# EAGLE design Flodar_Board_V1-2 (EAGLE 9.6.2)
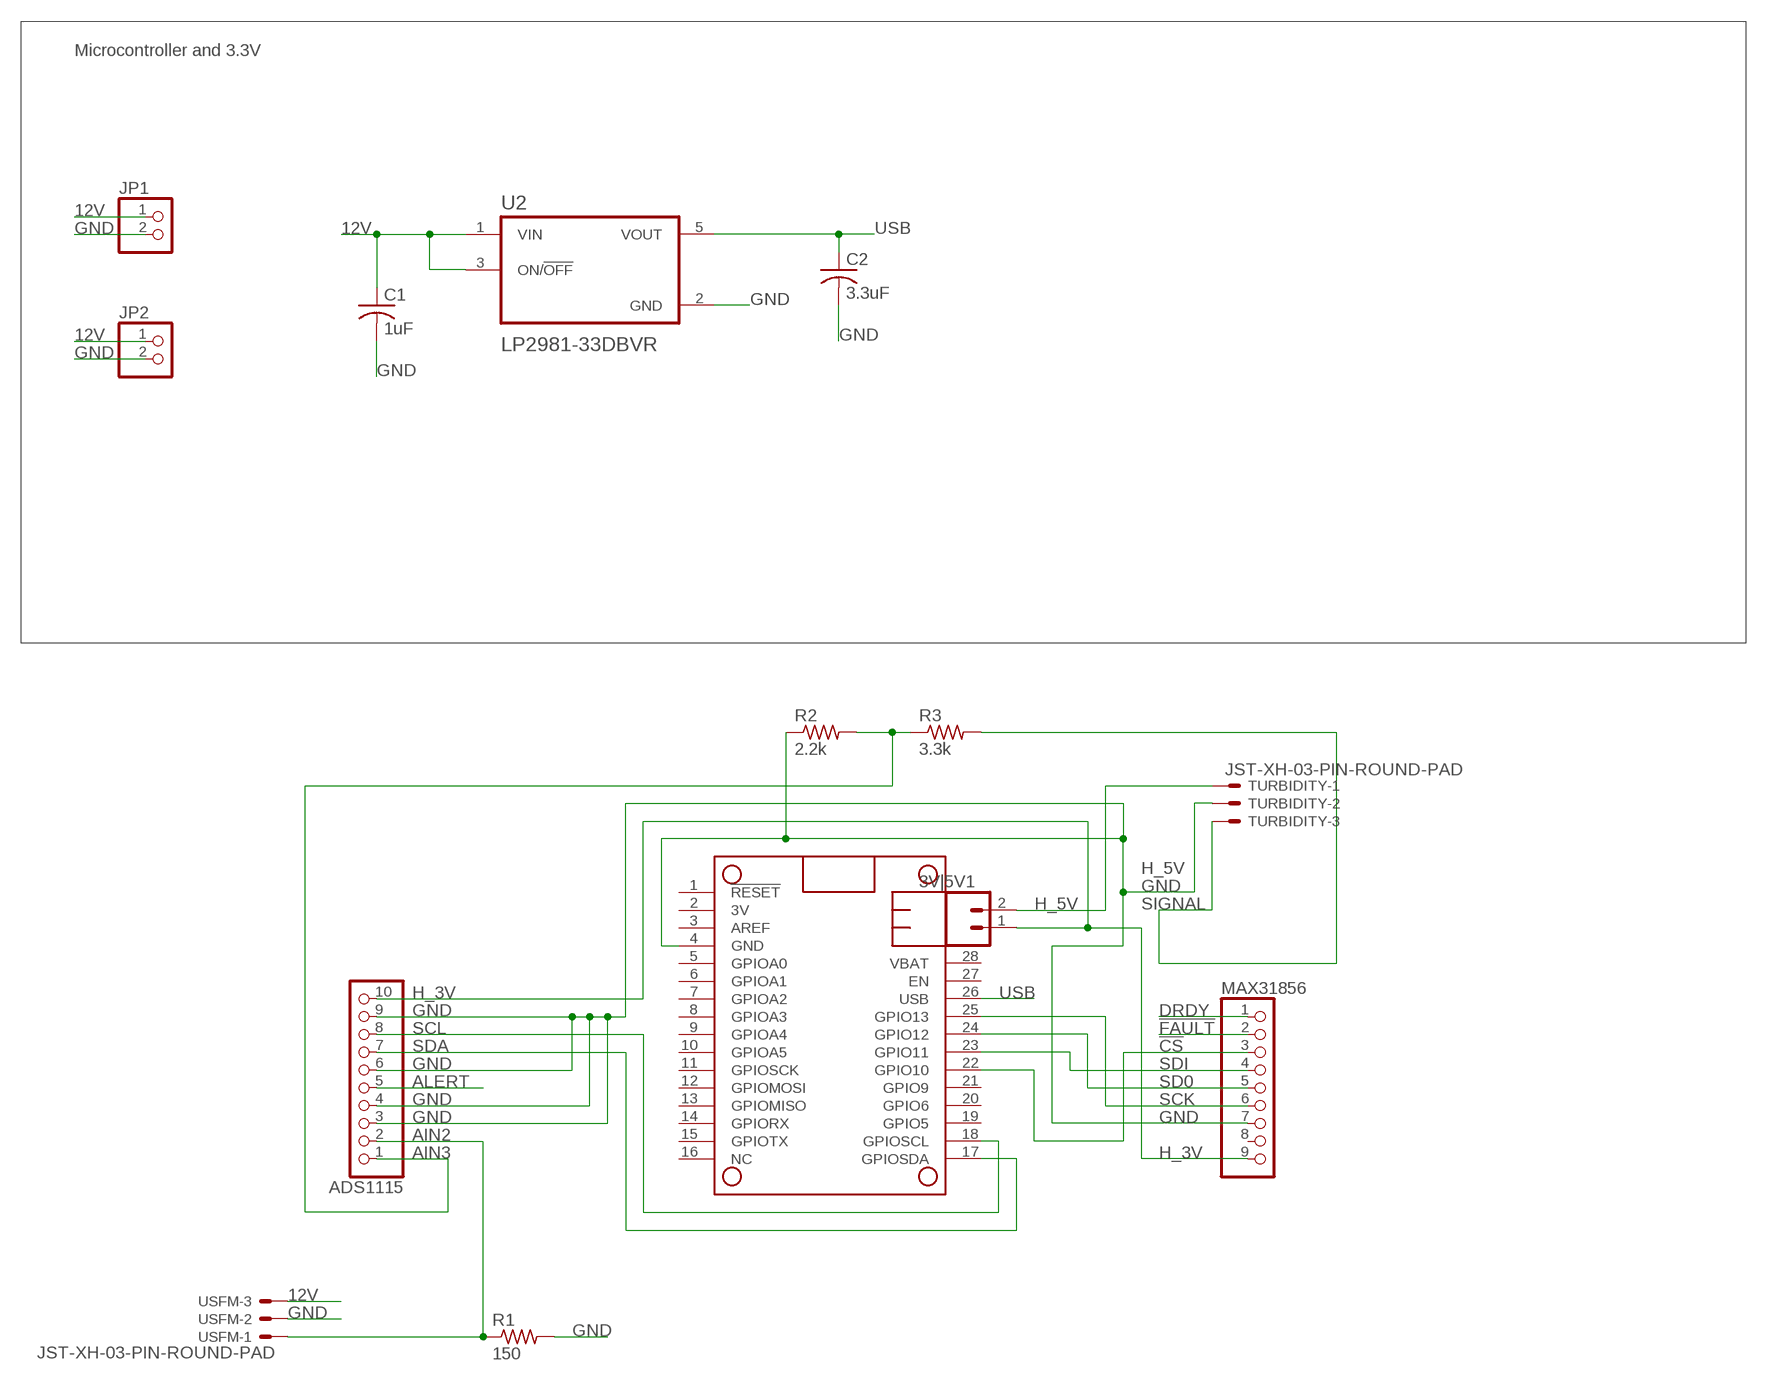
[diagram p0: schematic, sheet 1]

## Parts
3V|5V1  CONN_021X02_NO_SILK  [1X02_NO_SILK]
ADS1115  HEADER-1X1070MIL  [1X10_ROUND70]
C1  1uF  C-USC1206  [C1206]
C2  3.3uF  C-USC1206  [C1206]
JP1  PINHD-1X2  [1X02]
JP2  PINHD-1X2  [1X02]
MAX31856  HEADER-1X970MIL  [1X09_ROUND_70]
MS3  FEATHERWING  [FEATHERWING]
R1  150  R-US_R1206  [R1206]
R2  2.2k  R-US_R1206  [R1206]
R3  3.3k  R-US_R1206  [R1206]
TURBIDITY  JST-XH-03-PIN-ROUND-PAD  [JST-XH-03-PACKAGE-ROUND-PAD]
U2  LP2981-33DBVR  LP2981-50DBVR  [SOT95P280X145-5N]
USFM  JST-XH-03-PIN-ROUND-PAD  [JST-XH-03-PACKAGE-ROUND-PAD]

## Nets
12V: C1.1 JP1.1 JP2.1 U2.1(VIN) U2.3(ON/!OFF) USFM.3
!CS: MAX31856.3 MS3.22(GPIO10)
!FAULT: MAX31856.2
AIN2: ADS1115.2 R1.1 USFM.1
AIN3: ADS1115.1 R2.2 R3.1
ALERT: ADS1115.5
DRDY: MAX31856.1
GND: ADS1115.3 ADS1115.4 ADS1115.6 ADS1115.9 C1.2 C2.2 JP1.2 JP2.2 MAX31856.7 MS3.4(GND) R1.2 R2.1 TURBIDITY.2 U2.2(GND) USFM.2
H_3V: 3V|5V1.1 ADS1115.10 MAX31856.9
H_5V: 3V|5V1.2 TURBIDITY.1
SCK: MAX31856.6 MS3.25(GPIO13)
SCL: ADS1115.8 MS3.18(GPIOSCL)
SD0: MAX31856.5 MS3.24(GPIO12)
SDA: ADS1115.7 MS3.17(GPIOSDA)
SDI: MAX31856.4 MS3.23(GPIO11)
SIGNAL: R3.2 TURBIDITY.3
USB: C2.1 MS3.26(USB) U2.5(VOUT)
Unconnected: MAX31856.8 MS3.1(!RESET) MS3.2(3V) MS3.3(AREF) MS3.5(GPIOA0) MS3.6(GPIOA1) MS3.7(GPIOA2) MS3.8(GPIOA3) MS3.9(GPIOA4) MS3.10(GPIOA5) MS3.11(GPIOSCK) MS3.12(GPIOMOSI) MS3.13(GPIOMISO) MS3.14(GPIORX) MS3.15(GPIOTX) MS3.16(NC) MS3.19(GPIO5) MS3.20(GPIO6) MS3.21(GPIO9) MS3.27(EN) MS3.28(VBAT)

## Notes on the sheet
- Microcontroller and 3.3V

## Library data of the parts
3V|5V1 = SparkFun-Connectors:CONN_02: Multi connection point. Often used as Generic Header-pin footprint for 0.1 inch spaced/style header connections On any of the 0.1 inch spaced packages, you can populate with these: Break Away Headers - Straight <https://www.sparkfun.com/products/116> (PRT-00116) Break Away Male Headers - Right Angle <https://www.sparkfun.com/products/553> (PRT-00553) Female Headers <https://www.sparkfun.com/products/115> (PRT-00115) Break Away Headers - Machine Pin <https://www.sparkfun.com/products/117> (PRT-00117) Break Away Female Headers - Swiss Machine Pin <https://www.sparkfun.com/products/743> (PRT-00743) For SCREWTERMINALS and SPRING TERMINALS visit here: Screw Terimnals on SparkFun.com <https://www.sparkfun.com/search/results?term=Screw+Terminals> (5mm/3.5mm/2.54mm spacing) This device is also useful as a general connection point to wire up your design to another part of your project. Our various solder wires solder well into these plated through hole pads. Hook-Up Wire - Assortment (Stranded, 22 AWG) <https://www.sparkfun.com/products/11375> (PRT-11375) Hook-Up Wire - Assortment (Solid Core, 22 AWG) <https://www.sparkfun.com/products/11367> (PRT-11367) View the entire wire category on our website here <https://www.sparkfun.com/categories/141> Special notes: Molex polarized connector foot print use with: PRT-08233 with associated crimp pins and housings. 2.54_SCREWTERM for use with PRT-10571. 3.5mm Screw Terminal footprints for PRT-08084 5mm Screw Terminal footprints for use with PRT-08432
ADS1115 = microbuilder:HEADER-1X10: PIN HEADER
C1 C2 = rcl:C-US: CAPACITOR, American symbol; SPICEPREFIX: C
JP1 JP2 = pinhead:PINHD-1X2: PIN HEADER
MAX31856 = microbuilder:HEADER-1X9: PIN HEADER
MS3 = adafruit_wing:FEATHERWING
R1-R3 = adafruit:R-US_: RESISTOR, American symbol
TURBIDITY USFM = Rembrandt Electronics - JST XH Connectors v1-0:JST-XH-03-PIN: JST XH Connector 2 Pin Wire to board connector. Pitch: 2,54 mm, (0.100") Number of pins: 3 Created by Rembrandt Electronics www.rembrandtelectronics.com
U2 = LP2981-33DBVR:LP2981-50DBVR: Check prices <https://pricing.snapeda.com/parts/LP2981-50DBVR/Texas%20Instruments/view-part?ref=eda>; AVAILABILITY: In Stock; DESCRIPTION: 100-mA, 16-V, low-dropout voltage regulator with enable 5-SOT-23 -40 to 125; MF: Texas Instruments; MP: LP2981-50DBVR; PACKAGE: SOT-23-5 Texas Instruments; PRICE: None; PURCHASE-URL: https://pricing.snapeda.com/search/part/LP2981-50DBVR/?ref=eda

## Board
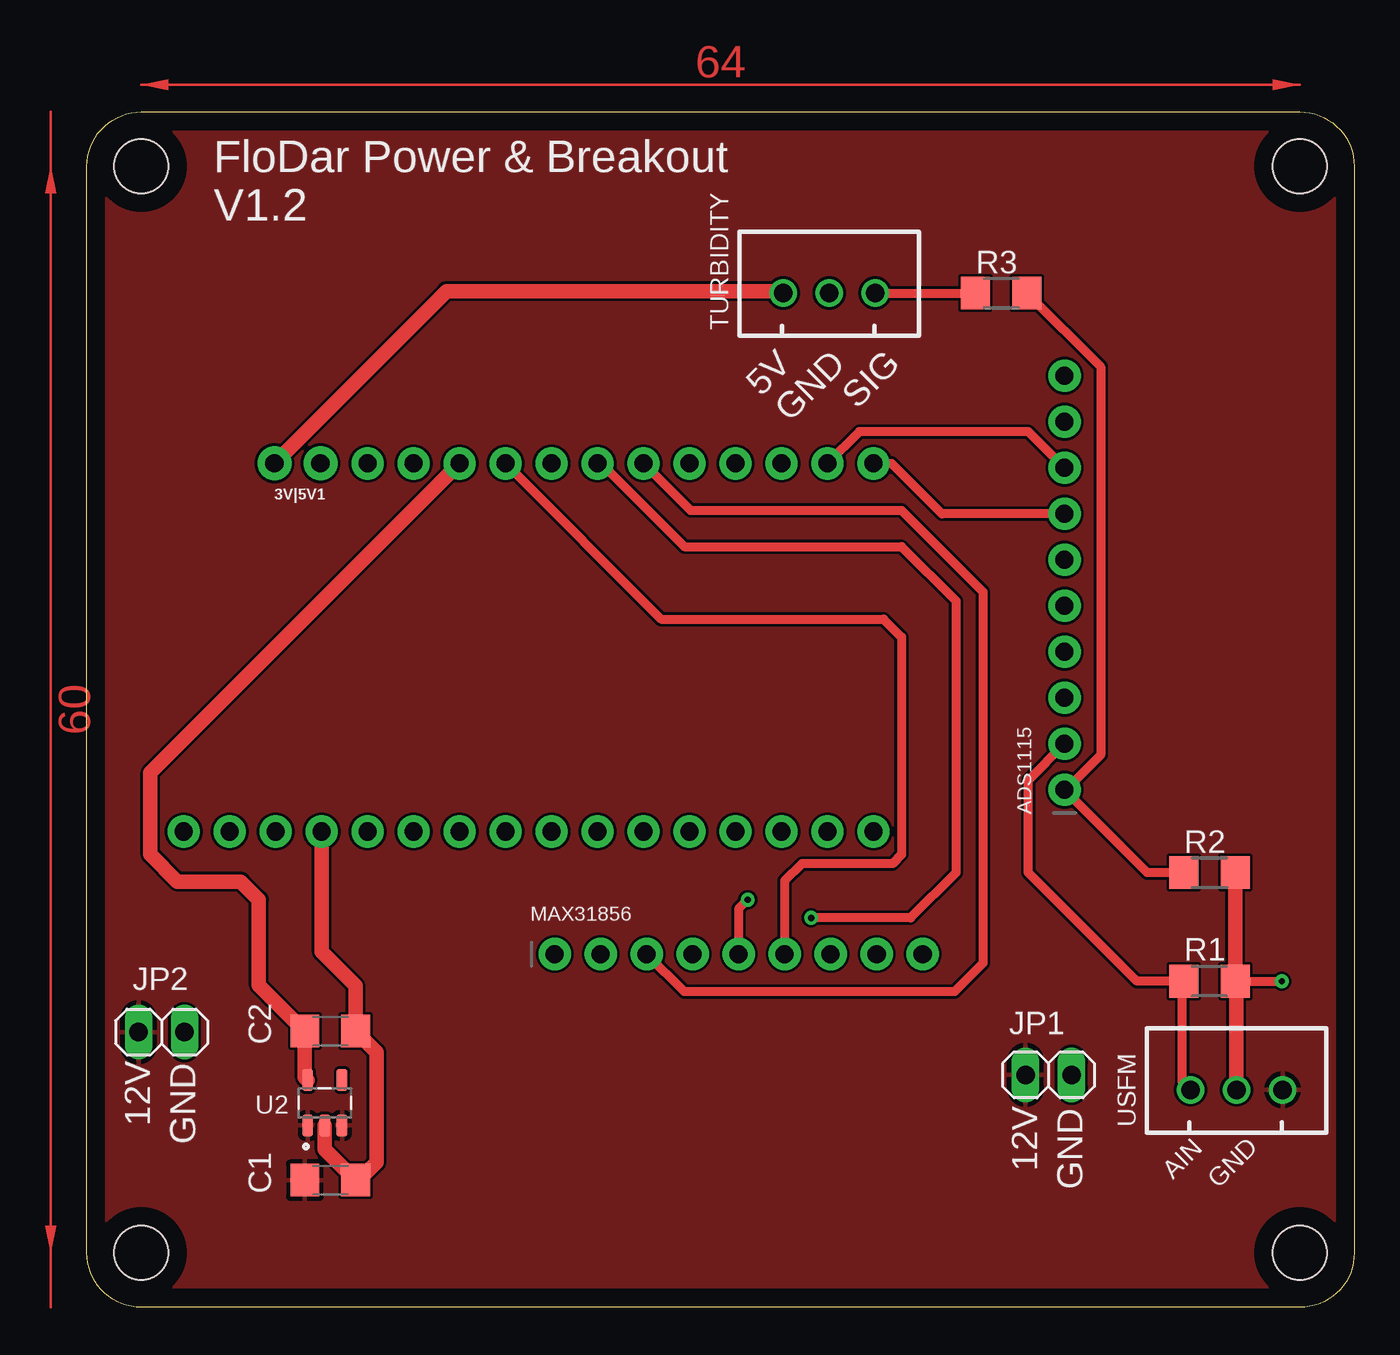
[diagram p1: board, top side]
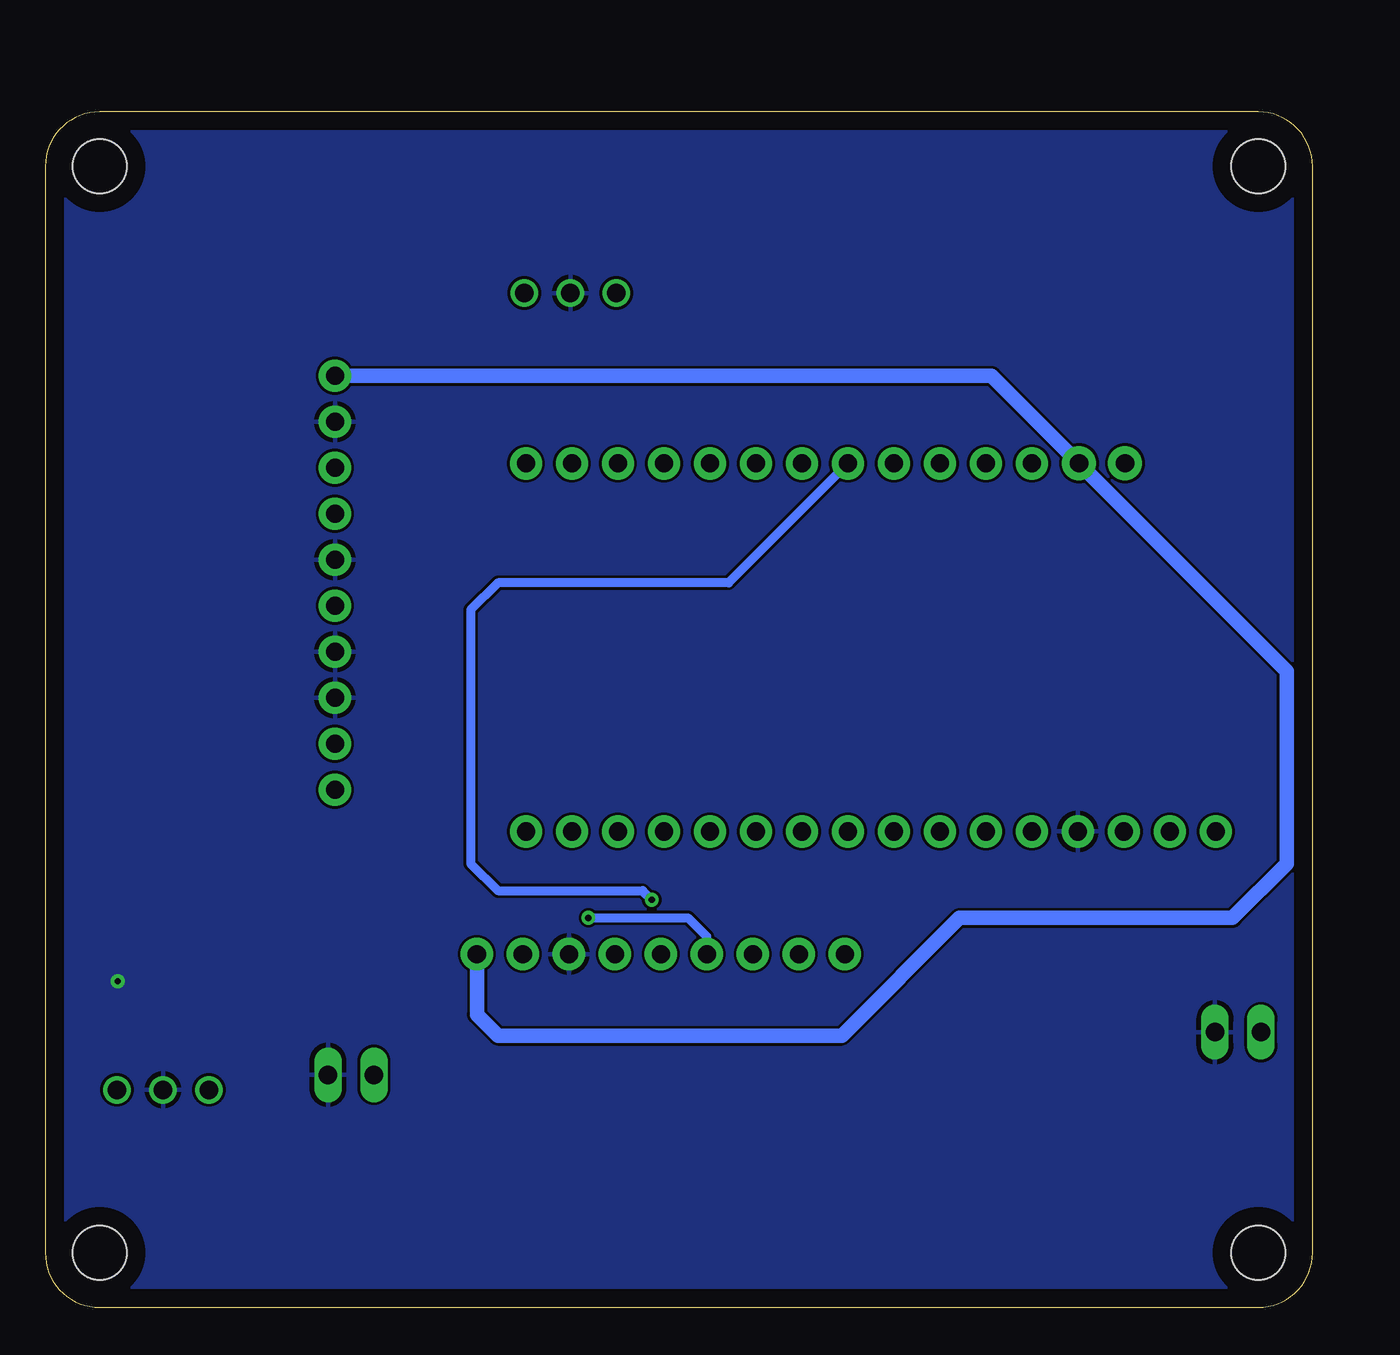
[diagram p2: board, bottom side, seen from below]

Size 70 x 66 mm. Coordinates in mm from the lower left corner, seen from the top.
Outline: 0,63 arc-90 3,66 67,66 arc-90 70,63 70,3 arc-90 67,0 3,0 arc-90 0,3 0,63
Copper layers (1*16): Top 0.035mm / dielectric 1.5mm / Bottom 0.035mm
Design rules "default": minimum track width 6mil, minimum drill 0.35mm, track to track 6mil, track to pad 6mil, pad to pad 6mil, via to via 6mil, smd to smd 6mil, copper to edge 40mil, drill to drill 6mil, minimum pad ring 10mil, minimum via ring 8mil, stop-mask expansion 4mil, vias tented up to drill 0mil, thermal gap 10mil
Holes 3 mm at 67,3 67,63 3,63 3,3

### Footprints (pad centres in the part's own frame; a part is rotated, then mirrored left to right if it is on the bottom)
1X02_NO_SILK = drill 1.016 pad 1.88: 1 0,0; 2 2.54,0
1X10_ROUND70 = drill 1 pad 1.778: 1 -11.43,0; 2 -8.89,0; 3 -6.35,0; 4 -3.81,0; 5 -1.27,0; 6 1.27,0; 7 3.81,0; 8 6.35,0; 9 8.89,0; 10 11.43,0
C1206 = smd 1.6 x 1.8: 1 -1.4,0; 2 1.4,0
1X02 = drill 1.016 long: 1 -1.27,0; 2 1.27,0
1X09_ROUND_70 = drill 1 pad 1.778: 1 -10.16,0; 2 -7.62,0; 3 -5.08,0; 4 -2.54,0; 5 0,0; 6 2.54,0; 7 5.08,0; 8 7.62,0; 9 10.16,0
FEATHERWING = drill 1 pad 1.778: 1 6.35,1.27; 2 8.89,1.27; 3 11.43,1.27; 4 13.97,1.27; 5 16.51,1.27; 6 19.05,1.27; 7 21.59,1.27; 8 24.13,1.27; 9 26.67,1.27; 10 29.21,1.27; 11 31.75,1.27; 12 34.29,1.27; 13 36.83,1.27; 14 39.37,1.27; 15 41.91,1.27; 16 44.45,1.27; 17 44.45,21.59; 18 41.91,21.59; 19 39.37,21.59; 20 36.83,21.59; 21 34.29,21.59; 22 31.75,21.59; 23 29.21,21.59; 24 26.67,21.59; 25 24.13,21.59; 26 21.59,21.59; 27 19.05,21.59; 28 16.51,21.59
R1206 = smd 1.6 x 1.803: 1 -1.422,0; 2 1.422,0
JST-XH-03-PACKAGE-ROUND-PAD = drill 1.016: 1 -2.54,0; 2 0,0; 3 2.54,0
SOT95P280X145-5N = smd 1.21 x 0.59: 1 -1.255,0.95; 2 -1.255,0; 3 -1.255,-0.95; 4 1.255,-0.95; 5 1.255,0.95

### Placement (x,y rotation side)
3V|5V1  12.9,46.6 180 top
ADS1115  54,40 90 top
C1  13.44,7.02 0 top
C2  13.44,15.25 0 top
JP1  53.11,12.83 0 top
JP2  4.12,15.19 0 top
MAX31856  36,19.5 0 top
MS3  -1,25 0 top
R1  62,18 0 top
R2  62,24 180 top
R3  50.5,56 180 top
TURBIDITY  41,56 0 top
U2  13.14,11.29 90 top
USFM  63.5,12 0 top

### Tracks (layer width: path | path; a pad name or v marks a point on that pad's centre or on a via)
12V
  pour Top: 0,66 0,0 70,0 70,66
!CS
  Top 0.508: MS3.22 33.34,44 45,44 49.5,39.5 49.5,19 47.92,17.42 33,17.42 MAX31856.3
AIN2
  Top 0.508: R1.1 58,18 52,24 52,29.11 ADS1115.2 | USFM.1 60.5,12.46 60.5,17.92
  Top 0.813: 60.5,17.92 R1.1
AIN3
  Top 0.508: R2.2 58.57,24 ADS1115.1 54.07,28.57 56,30.5 56,51.92 R3.1
GND  (via drill 0.35)
  Top 0.508: R1.2 v66,18
  Top 0.813: U2.2 13.14,8.72 C1.2 15.02,7.02 16,8 16,14.09 C2.2 14.84,17.75 12.97,19.62 MS3.4 | USFM.2 63.5,17.92 R1.2 R2.1
  pour Bottom: 0,66 0,0 70,0 70,66
H_3V
  Bottom 0.813: ADS1115.10 17.73,51.43 3V|5V1.1 1.42,35.12 1.42,24.5 4.42,21.5 19.5,21.5 26,15 45,15 46.16,16.16 MAX31856.9
H_5V
  Top 0.813: 3V|5V1.2 19.86,56.1 38.36,56.1 TURBIDITY.1
SCK
  Top 0.508: MS3.25 31.72,38 44,38 45,37 45,25 44.5,24.5 39.5,24.5 38.54,23.54 MAX31856.6
SCL
  Top 0.508: ADS1115.8 52,48.35 42.67,48.35 MS3.18
SD0  (via drill 0.35)
  Top 0.508: v36.5,22.5 36,22 MAX31856.5
  Bottom 0.508: v36.5,22.5 37,23 45,23 46.5,24.5 46.5,38.5 45,40 32.26,40 MS3.24
SDA
  Top 0.508: ADS1115.7 47.23,43.81 44.45,46.59 MS3.17
SDI  (via drill 0.35)
  Top 0.508: MS3.23 28.41,46.59 33,42 45,42 48,39 48,24 45.5,21.5 v40,21.5
  Bottom 0.508: v40,21.5 34.5,21.5 33.46,20.46 MAX31856.4
SIGNAL
  Top 0.508: TURBIDITY.3 R3.2
USB
  Top 0.813: U2.5 12.04,12.7 C2.1 9.5,17.79 9.5,22.5 8.5,23.5 5,23.5 3.5,25 3.5,29.5 MS3.26
(copper drawn outside any net)
  shapes: Top area x4

### Text on the board
tPlace: 5V | GND | SIG | 12V | GND | 12V | AIN | GND | GND
tNames: FloDar Power & Breakout / V1.2